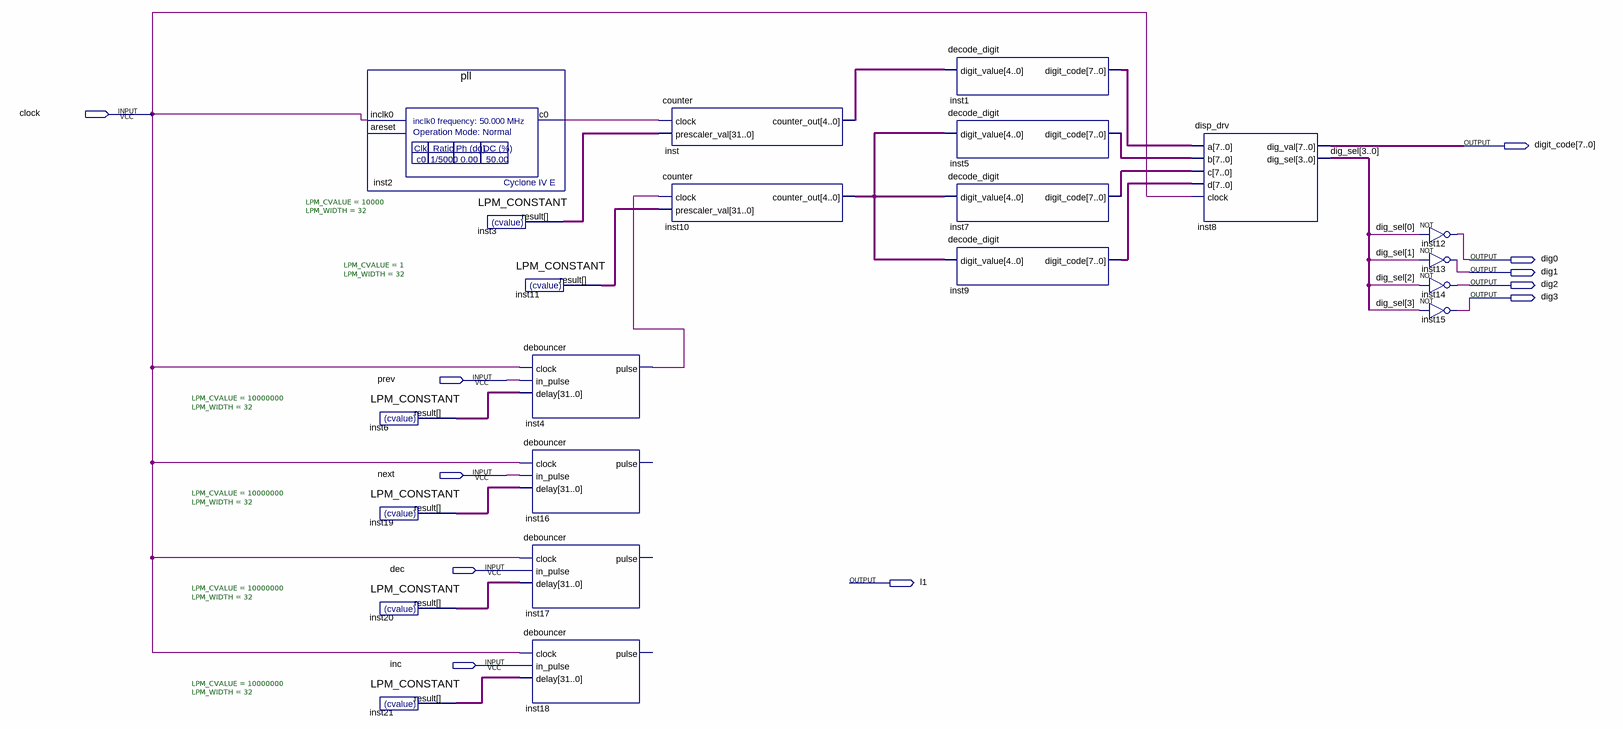
[diagram p0: schematic sheet]
// Quartus schematic alu.bdf as structural Verilog: 22 symbols, 11 pins
module alu (
  input  clock,
  input  prev,
  input  next,
  input  dec,
  input  inc,
  output [7:0] digit_code,
  output dig0,
  output dig1,
  output dig2,
  output dig3,
  output l1
);

  wire inst2_c0, inst4_pulse;
  wire [3:0] dig_sel;
  wire [4:0] inst10_counter_out, inst_counter_out;
  wire [7:0] inst1_digit_code, inst5_digit_code, inst7_digit_code, inst9_digit_code;
  wire [31:0] inst3_result, inst6_result, inst11_result, inst19_result, inst20_result, inst21_result;

  pll inst2 (.inclk0(clock), .c0(inst2_c0));  // open: areset
  LPM_CONSTANT #(.LPM_CVALUE(10000000), .LPM_WIDTH(32)) inst6 (.result(inst6_result));
  LPM_CONSTANT #(.LPM_CVALUE(10000000), .LPM_WIDTH(32)) inst19 (.result(inst19_result));
  LPM_CONSTANT #(.LPM_CVALUE(10000000), .LPM_WIDTH(32)) inst20 (.result(inst20_result));
  LPM_CONSTANT #(.LPM_CVALUE(10000000), .LPM_WIDTH(32)) inst21 (.result(inst21_result));
  LPM_CONSTANT #(.LPM_CVALUE(10000), .LPM_WIDTH(32)) inst3 (.result(inst3_result));
  LPM_CONSTANT #(.LPM_CVALUE(1), .LPM_WIDTH(32)) inst11 (.result(inst11_result));
  debouncer inst4 (.clock(clock), .in_pulse(prev), .delay(inst6_result), .pulse(inst4_pulse));
  debouncer inst16 (.clock(clock), .in_pulse(next), .delay(inst19_result));  // open: pulse
  debouncer inst17 (.clock(clock), .in_pulse(dec), .delay(inst20_result));  // open: pulse
  debouncer inst18 (.clock(clock), .in_pulse(inc), .delay(inst21_result));  // open: pulse
  counter inst (.clock(inst2_c0), .prescaler_val(inst3_result), .counter_out(inst_counter_out));
  counter inst10 (.clock(inst4_pulse), .prescaler_val(inst11_result), .counter_out(inst10_counter_out));
  decode_digit inst1 (.digit_value(inst_counter_out), .digit_code(inst1_digit_code));
  decode_digit inst5 (.digit_value(inst10_counter_out), .digit_code(inst5_digit_code));
  decode_digit inst7 (.digit_value(inst10_counter_out), .digit_code(inst7_digit_code));
  decode_digit inst9 (.digit_value(inst10_counter_out), .digit_code(inst9_digit_code));
  disp_drv inst8 (
    .a(inst1_digit_code), .b(inst5_digit_code), .c(inst7_digit_code), .d(inst9_digit_code), .clock(clock),
    .dig_val(digit_code), .dig_sel(dig_sel));
  not inst12 (dig0, dig_sel[0]);
  not inst13 (dig1, dig_sel[1]);
  not inst14 (dig2, dig_sel[2]);
  not inst15 (dig3, dig_sel[3]);
endmodule
